# Altium schematic sheet Sensors.SchDoc
size A4
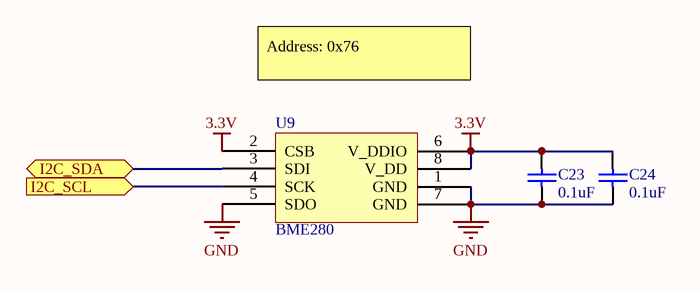
[diagram p0: Sensors.SchDoc]

## Parts
C23  value 0.1uF  [0603_CAP]  (hidden comment: Capacitor)
C24  value 0.1uF  [0603_CAP]  (hidden comment: Capacitor)
U9  BME280  [BME280]

## Ports
I2C_SCL (in), I2C_SDA (bidir)

## Nets
3.3V: C23.2 C24.2 U9.2(CSB) U9.6(V_DDIO) U9.8(V_DD)
GND: C23.1 C24.1 U9.1(GND) U9.5(SDO) U9.7(GND)
I2C_SCL: U9.4(SCK) ; port I2C_SCL
I2C_SDA: U9.3(SDI) ; port I2C_SDA

## Notes on the sheet
- Address: 0x76

## Library data of the parts
C23 C24 = Capacitor: Max_V: 25V
U9 = BME280: Combined humidity and pressure sensor; Supplier 1: Mouser; Supplier Part Number 1: 262-BME280